# Altium project Power_Board_2.PrjPcb (part 3 of 4)

## Sheet Power_Internal.SchDoc
size A4; SheetNumber: 6
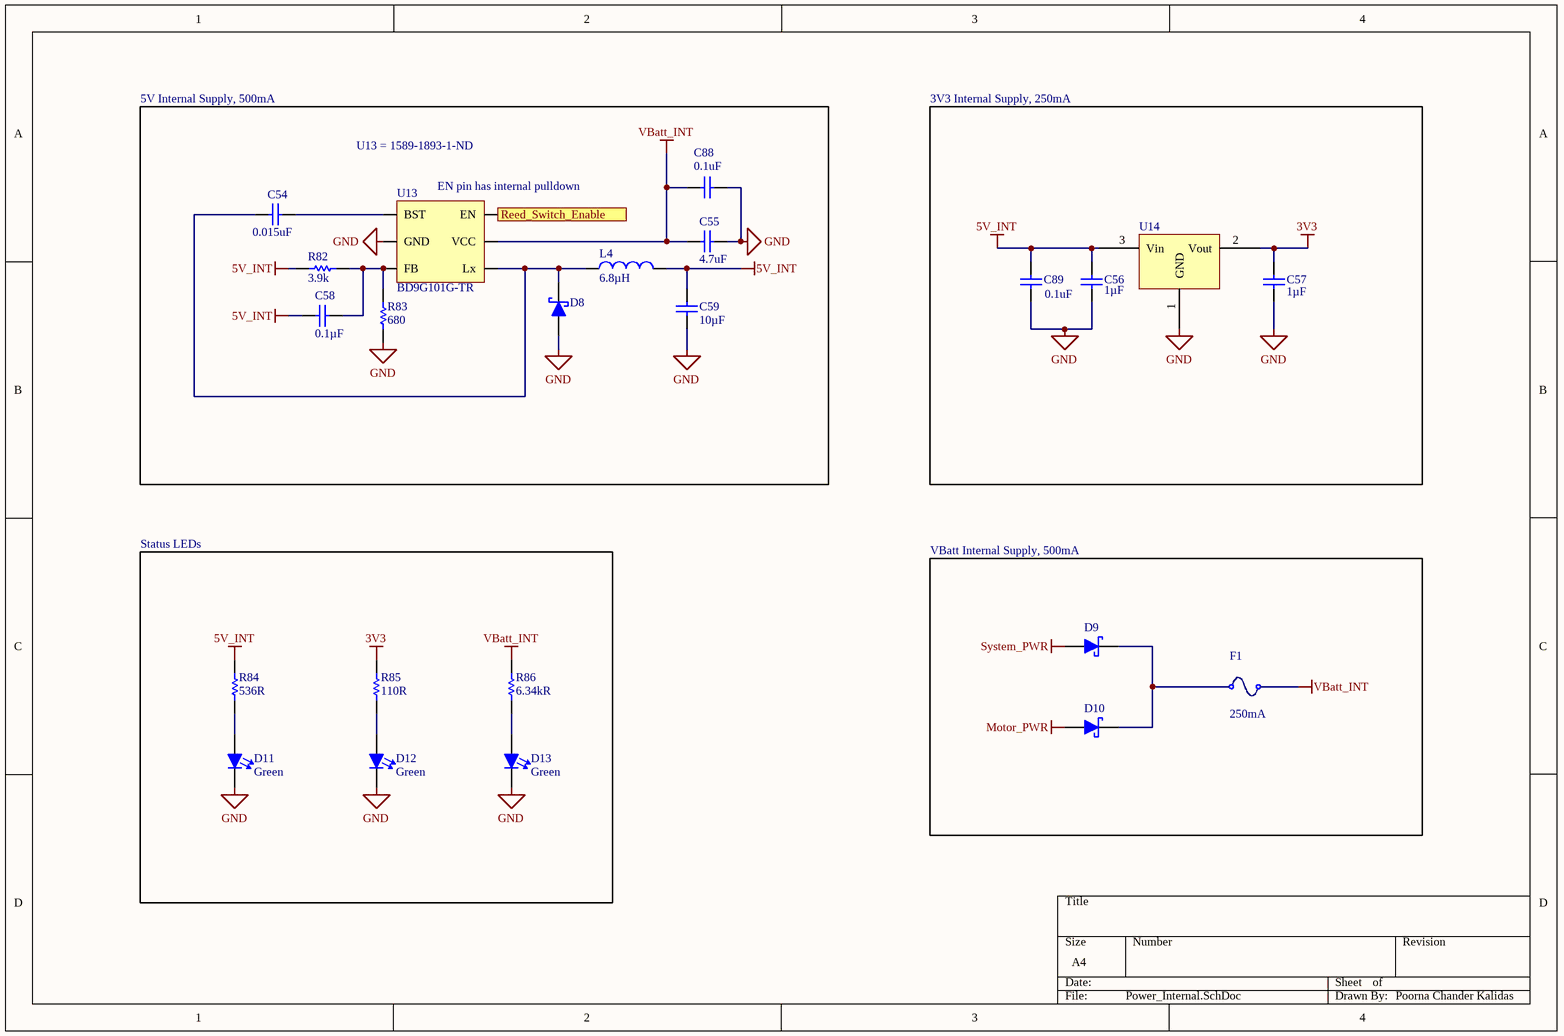
[diagram p4: Power_Internal.SchDoc]

### Parts
C54  value 0.015uF  [CAPC1608N(0603")]  (hidden comment: 0.015uF 50V 0603 SMD, Ceramic)
C55  value 4.7uF  [CAPC3216N(1206")]  (hidden comment: 4.7uF 50V 1206 SMD, Ceramic)
C56  value 1µF  [CAPC1608N(0603")]  (hidden comment: 1uF 25V 0603 SMD, Ceramic)
C57  value 1µF  [CAPC1608N(0603")]  (hidden comment: 1uF 25V 0603 SMD, Ceramic)
C58  Capacitance: 0.1µF  [CAPC1608N(0603")]  (hidden comment: 0.1uF, 50V, 10%, X7R, 1608)
C59  value 10µF  [CAPC2012N(0805")]  (hidden comment: 10uF 10V 0805 SMD, Ceramic)
C88  Capacitance: 0.1uF  [FP-CL10-0_1-IPC_A]  (hidden comment: CL10B104JB8NNNC)
C89  Capacitance: 0.1uF  [FP-CL10-0_1-IPC_A]  (hidden comment: CL10B104JB8NNNC)
D8  RB060M-60TR  [SOD-123]  (value not drawn)
D9  DSS14UTR  [SOD-123F]  (value not drawn)
D10  DSS14UTR  [SOD-123F]  (value not drawn)
D11  Color: Green  [FP-LB_Q39E-MFG]  (hidden comment: LT Q39G-Q1OO-25-1)
D12  Color: Green  [FP-LB_Q39E-MFG]  (hidden comment: LT Q39G-Q1OO-25-1)
D13  Color: Green  [FP-LB_Q39E-MFG]  (hidden comment: LT Q39G-Q1OO-25-1)
F1  Current: 250mA  [1206 SMD]  (hidden comment: SMD Fuse, 250mA, 63V, 1206)
L4  value 6.8µH  [NR4018T6R8M Inductor]  (hidden comment: NR4018T6R8M)
R82  value 3.9k  [RESC2012N(0805")]  (hidden comment: 3.9k, 5%, 1/8W, 0805 SMD)
R83  value 680  [RESC2012N(0805")]  (hidden comment: 680, 5%, 1/8W, 0805 SMD)
R84  Resistance: 536R  [RESC1608X55X30ML15T15]  (hidden comment: ERJ-3EKF5360V)
R85  Resistance: 110R  [RESC1608X55X25ML10T15]  (hidden comment: RC0603FR-07110RL)
R86  Resistance: 6.34kR  [RESC1609X50X30ML10T20]  (hidden comment: CRCW06036K34FKEA)
U13  BD9G101G-TR  [SOT23-6_N]
U14  3.3V 250mA Linear Reg LDO  [SOT95P245X110-3N]  (value not drawn)

### Blocks framed on the sheet
3V3 Internal Supply, 250mA: C56 C57 C89 U14
Status LEDs: D11-D13 R84-R86
VBatt Internal Supply, 500mA: D9 D10 F1

### Ports
Reed_Switch_Enable (in)

### Nets
3V3: C57.2(Cathode) R85.2 U14.2(Vout)
5V_INT: C56.2(Cathode) C58.1(Anode) C59.2(Cathode) C89.1 L4.2 R82.1 R84.1 U14.3(Vin)
GND: C55.1 C56.1(Anode) C57.1(Anode) C59.1(Anode) C88.2 C89.2 D8.A(Anode) D11.1(Cathode) D12.1(Cathode) D13.1(Cathode) R83.1 U13.2(GND) U14.1(GND)
Motor_PWR: D10.A(Anode)
System_PWR: D9.A(Anode)
VBatt_INT: C55.2 C88.1 F1.1 R86.2 U13.5(VCC)
NetC54_1: C54.1 D8.K(Cathode) L4.1 U13.6(Lx)
NetC54_2: C54.2 U13.1(BST)
NetC58_2: C58.2(Cathode) R82.2 R83.2 U13.3(FB)
NetD9_K: D9.K(Cathode) D10.K(Cathode) F1.2
NetD11_2: D11.2(Anode) R84.2
NetD12_2: D12.2(Anode) R85.1
NetD13_2: D13.2(Anode) R86.1
NetQ10_3: U13.4(EN) ; port Reed_Switch_Enable

### Notes on the sheet
- 5V Internal Supply, 500mA
- U13 = 1589-1893-1-ND
- (near U13) EN pin has internal pulldown
- Poorna Chander Kalidas

### Library data of the parts
C54 = CMP-006-0000-3: Capacitor, Ceramic, 50V, +/-10%, 0603 SMD, X7R; Created By: Lyden Smith; Created On: 2017-06-04; Design Item ID: 0.015uF 50V 0603 SMD, Ceramic; Component Type: Standard; Source: AUVic_Schematic_Library_Capacitors.SchLib; Pin Count: 2
C55 = CMP-006-0045-3: Capacitor, Ceramic, 50V, +/- 10%, 1206 SMD, X7R; Created By: Lyden Smith; Created On: 2017-06-04; Component Type: Standard; Pin Count: 2; Design Item ID: 4.7uF 50V 1206 SMD, Ceramic; Source: AUVic_Schematic_Library_Capacitors.SchLib
C56 C57 = CMP-006-0027-1: Capacitor, Ceramic, 25V, +/- 10%, 0603 SMD, X5R; MFG: Murata-Electronics-North-America; MFG#: GRM188R61E105KA12D; Created By: Andy Bates; Publisher: AUVic; Source: AUVic_Schematic_Library_Capacitors.SchLib; Component Type: Standard; Pin Count: 2; PackageDescription: Chip Capacitor; Design Item ID: 1uF 25V 0603 SMD, Ceramic; Published: 16-06-27
C58 = CMP-006-0008-1: CAP CER 0.1UF 50V 10% X7R 1608 (0603); Manufacturer: Samsung Electro-Mechanics America, Inc; Manufacturer Part Number: CL10B104KB8SFNC; RoHS: RoHS Compliant; Category: Capacitors; Stock 1: 743572; Pricing 1: 1=0.12, 10=0.033, 25=0.0232, 100=0.0152, 500=0.01064, 1000=0.00829 (CAD); Packaging: Cut Tape (CT); Tolerance: ±10%; Voltage - Rated: 50V; Temperature Coefficient: X7R; Mounting Type: Surface Mount, MLCC; Operating Temperature: -55°C ~ 125°C; Applications: Boardflex Sensitive; Ratings: -; Package / Case: 0603 (1608 Metric); Size / Dimension: 0.063" L x 0.031" W (1.60mm x 0.80mm); Height - Seated (Max): -; Thickness (Max): 0.035" (0.90mm); Lead Spacing: -; Features: Soft Termination; Lead Style: -; ComponentLink1URL: http://www.samsungsem.com/servlet/FileDownload?type=spec&file=CL10B104KB8SFNC.pdf; ComponentLink1Description: http://www.samsungsem.com/servlet/FileDownload?type=spec&file=CL10B104KB8SFNC.pdf; Design Item ID: 0.1uF, 50V, 10%, X7R, 1608; Component Type: Standard; Source: AUVic_Schematic_Library_Capacitors.SchLib; Pin Count: 2
C59 = CMP-006-0017-1: Capacitor, Ceramic, 10V, +/- 10%, 0805 SMD, X5R; Made By: Andy Bates; Published: 14-06-23; Publisher: AUVic; PackageDescription: Chip Capacitor; Source: AUVic_Schematic_Library_Capacitors.SchLib; Pin Count: 2; Design Item ID: 10uF 10V 0805 SMD, Ceramic; Component Type: Standard
C88 C89 = CMP-00000-4: CAP CER 0.1UF 50V X7R 0603; Material: Ceramic; Tolerance: 5%; Dielectric: X7R; Width: 0.031inch; Min Operating Temperature: -55°C; Contact Plating: Tin; Length: 1.6mm; Case/Package: 0603; Package Quantity: 1; Voltage Rating: 50V; Voltage: 50V; Radiation Hardening: No; Packaging: Tape and Reel; Max Operating Temperature: 125°C; Case Code (Imperial): 0603; Thickness: 0.035inch; Case Code (Metric): 1608; Height: 0.8mm; Mount: Surface Mount; Depth: 0.8mm
D8 = CMP-057-0013-1: Diode, Schottky, 60V, 2A; Created By: Lyden Smith; Date Created: 2017-06-02; Component Type: Standard; Design Item ID: RB060M-60TR; Pin Count: 2; Source: AUVic_Schematic_Library_Diodes.SchLib
D9 D10 = CMP-057-0003-1: Diode, Schottky, 40V, 1A; Source: AUVic_Schematic_Library_Diodes.SchLib; Date Created: 2018-07-11; Component Type: Standard; Design Item ID: DSS14UTR; ComponentLink1Description: Digikey; Pin Count: 2; Created By: Robert Keen; ComponentLink1URL: https://www.digikey.ca/product-detail/en/smc-diode-solutions/DSS14UTR/1655-1927-1-ND/8341869; Publisher: AUVic
D11-D13 = CMP-00064-3: as D1 on sheet Battery_Management; Radiation Hardening: No; Packaging: Tape and Reel; Mount: Surface Mount; Max Operating Temperature: 85°C; Number of Elements: 1; Number of Pins: 2; Min Operating Temperature: -40°C; Depth: 0.9mm; Case/Package: SMD/SMT; Length: 1.7mm
F1 = CMP-027-0003-1: Source: AUVic_Integrated_Library_Fuses.SchLib; Type: SMD; Date Created: 2018-02-05; Component Type: Standard; Created By: Lyden Smith; Design Item ID: SMD Fuse, 250mA, 63V, 1206; Pin Count: 2
L4 = CMP-029-0008-1: 6.8uH 1.06A; Created By: Lyden Smith; Created On: 2017-06-02; Pin Count: 2; Design Item ID: NR4018T6R8M; Component Type: Standard; Source: AUVic_Integrated_Library_Inductors.SchLib
R82 = CMP-047-0041-1: Created By: Lyden Smith; Created On: 2017-06-04; Pin Count: 2; Design Item ID: 3.9k, 5%, 1/8W, 0805 SMD; Component Type: Standard; Source: AUVic_Schematic_Library_Resistors.SchLib
R83 = CMP-047-0063-1: Created By: Lyden Smith; Created On: 2017-06-04; Pin Count: 2; Source: AUVic_Schematic_Library_Resistors.SchLib; Component Type: Standard; Design Item ID: 680, 5%, 1/8W, 0805 SMD
R84 = CMP-00071-2: SMD Chip Resistor, 0603 [1608 Metric], 536 ohm, ERJ3EK Series, 75 V, Thick Film, 100 mW; Tolerance: 1%; Voltage Rating (DC): 50V; Voltage Rating: 75V; Power Rating: 100mW; Temperature Coefficient: 100ppm/°C; Max Operating Temperature: 155°C; Package Quantity: 1; REACH SVHC: No SVHC; Depth: 0.8mm; Composition: Thick Film; Height: 0.022inch; Packaging: Tape and Reel; Contact Plating: Tin; Lead Free: Lead Free; Length: 1.6mm; Case/Package: 0603; Military Standard: Not; Features: Automotive AEC-Q200; Termination: SMD/SMT; Max Power Dissipation: 100mW; Width: 0.8mm; Mount: Surface Mount; Case Code (Metric): 1608; Case Code (Imperial): 0603; Number of Terminations: 2; Min Operating Temperature: -55°C
R85 = CMP-00069-2: RES SMD 110 OHM 1% 1/10W 0603; Max Power Dissipation: 100mW; Voltage Rating (DC): 50V; Temperature Coefficient: 100ppm/°C; Working Voltage: 75V; Military Standard: Not; Termination: SMD/SMT; Number of Terminations: 2; Features: Moisture Resistant; Min Operating Temperature: -55°C; Power Rating: 100mW; Height: 0.022inch; Package Quantity: 1; Lead Free: Lead Free; Tolerance: 1%; Voltage Rating: 50V; Composition: Thick Film; Case Code (Imperial): 0603; Length: 1.6mm; Packaging: Tape and Reel; Case Code (Metric): 1608; Max Operating Temperature: 155°C; Depth: 0.8mm; Case/Package: 0603; Width: 0.031inch
R86 = CMP-00072-2: as R2 on sheet Battery_Management; Depth: 0.85mm; Military Standard: Not; Composition: Thick Film; Case Code (Metric): 1608; Case/Package: 0603; Packaging: Tape and Reel; Max Operating Temperature: 155°C; Tolerance: 1%; Height: 0.45mm; Package Quantity: 10; Case Code (Imperial): 0603; Width: 0.033inch; Length: 1.55mm; REACH SVHC: Unknown; Termination: SMD/SMT; Radiation Hardening: No; Contact Plating: Tin; Weight: 7.1E-05oz; Number of Pins: 2; Min Operating Temperature: -55°C; Features: Automotive AEC-Q200; Number of Terminations: 2; Max Power Dissipation: 100mW
U13 = CMP-045-0010-1: DC-DC Regulator, 6V-42V in, 1V-29.4V out, 500mA; Created on: 2017-06-02; Component Type: Standard; Pin Count: 6; Source: AUVic_Schematic_Library_Regulators.SchLib; Created by: Lyden Smith; Design Item ID: BD9G101G-TR
U14 = CMP-00003-1: IC REG LINEAR 3.3V 250MA SOT23-3; Max Input Voltage: 6.6V; Accuracy: 2%; Polarity: Positive; Number of Outputs: 1; Output Type: Fixed; Dropout Voltage: 400mV; Quiescent Current: 1uA; Min Input Voltage: 2.5V; Min Operating Temperature: -40°C; Supplier 1: Digi-Key; Supplier Part Number 1: AP2138N-3.3TRG1; Width: 1.7mm; Length: 3.02mm; Height: 1.3mm; Output Current: 250mA; Created By: Poorna Chander Kalidas; Number of Regulators: 1; Number of Pins: 3; Package Quantity: 3000; Date Created: June 26, 2020; Output Voltage: 3.3V; Max Operating Temperature: 85°C; Max Output Current: 250mA; Weight: 0.000282oz; Packaging: Tape and Reel; Lead Free: Lead Free; Mount: Surface Mount; Case/Package: SOT-23-3

## Sheet Sensors.SchDoc
size A4; SheetNumber: 9
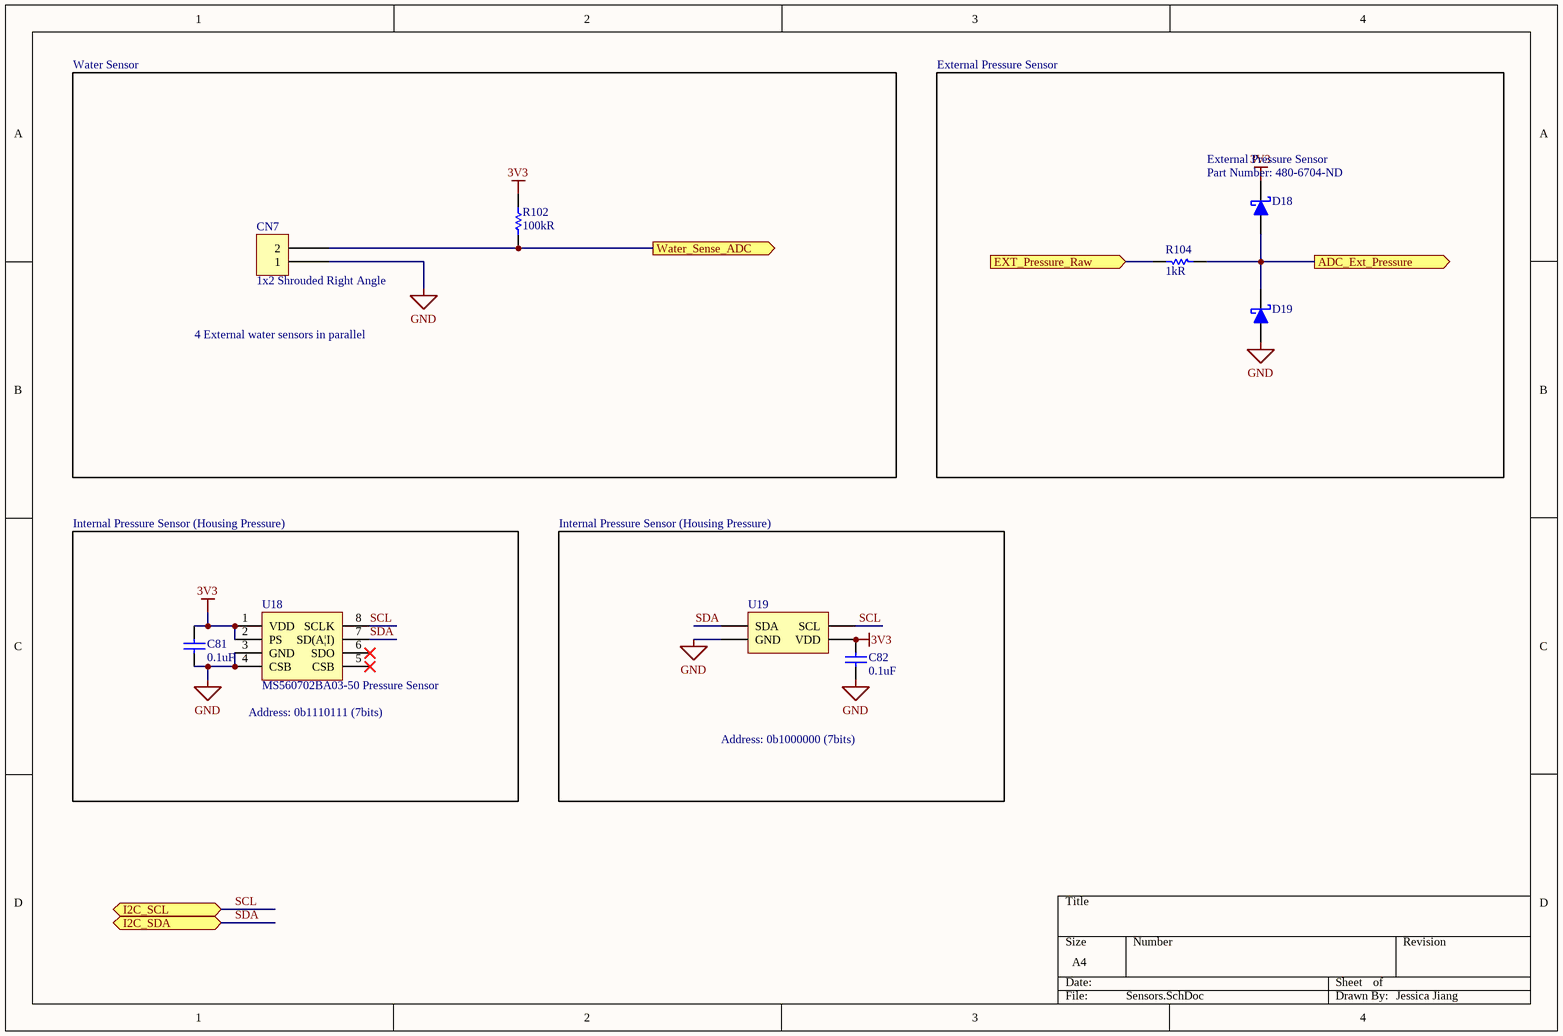
[diagram p5: Sensors.SchDoc]

### Parts
C81  Capacitance: 0.1uF  [FP-CL10-0_1-IPC_A]  (hidden comment: CL10B104JB8NNNC)
C82  Capacitance: 0.1uF  [FP-CL10-0_1-IPC_A]  (hidden comment: CL10B104JB8NNNC)
CN7  1x2 Shrouded Right Angle  [2X1 Female Header]
D18  CUS08F30,H3F  [SC-76]  (value not drawn)
D19  CUS08F30,H3F  [SC-76]  (value not drawn)
R102  Resistance: 100kR  [RESC1609X50X30ML10T20]  (hidden comment: CRCW0603-100KFKEA)
R104  Resistance: 1kR  [RESC1608X55X30ML15T15]  (hidden comment: ERJ3EKF1001V)
U18  MS560702BA03-50 Pressure Sensor  [TE Pressure Sensor (MS560702BA03-50)]
U19  Si700XX  [QFN-6]  (value not drawn)

### Ports
ADC_Ext_Pressure (out), EXT_Pressure_Raw (in), I2C_SCL (bidir), I2C_SDA (bidir), Water_Sense_ADC (out)

### Nets
3V3: C81.1 C82.1 D18.K(Cathode) R102.2 U18.1(VDD) U18.2(PS) U19.5(VDD)
GND: C81.2 C82.2 CN7.1 D19.A(Anode) U18.3(GND) U18.4(CSB) U19.2(GND)
EXT_Pressure_Raw: R104.2 ; port EXT_Pressure_Raw
SCL: U18.8(SCLK) U19.6(SCL) ; port I2C_SCL  [project net I2C_SCL]
SDA: U18.7(SD(A|I)) U19.1(SDA) ; port I2C_SDA  [project net I2C_SDA]
NetCN7_2: CN7.2 R102.1 ; port Water_Sense_ADC
NetD18_A: D18.A(Anode) D19.K(Cathode) R104.1 ; port ADC_Ext_Pressure

Not connected (* = marked no-connect by the designer): U18 5(CSB)* 6(SDO)*

### Notes on the sheet
- Water Sensor
- External Pressure Sensor
- Part Number: 480-6704-ND
- 4 External water sensors in parallel
- Internal Pressure Sensor (Housing Pressure)
- (near U18) Address: 0b1110111 (7bits)
- Address: 0b1000000 (7bits)
- Jessica Jiang

### Library data of the parts
C81 C82 = CMP-00000-4: as C1 on sheet Battery_Management; Case Code (Imperial): 0603; Mount: Surface Mount; Thickness: 0.035inch; Depth: 0.8mm; Packaging: Tape and Reel; Package Quantity: 1; Dielectric: X7R; Height: 0.8mm; Voltage: 50V; Radiation Hardening: No; Max Operating Temperature: 125°C; Voltage Rating: 50V; Case/Package: 0603; Min Operating Temperature: -55°C; Case Code (Metric): 1608; Length: 1.6mm; Contact Plating: Tin; Width: 0.031inch
CN7 = CMP-00010-3: 02 MTE HDR SRRA LATCH; PCB Mount Retention: Without; Number of Positions: 2; Row Spacing: 0.1inch; Contact Retention: Yes (With); PCB Mount Alignment: No (Without); Current Rating: 3A; PCB Thickness: 0.062inch; Insulation Resistance: 5GR; Gender: Male; Connector Type: Plug,Header,Pin; Tail Length: 3.3mm; Approvals: CSA; Pitch: 2.54mm; Contact Resistance: 15mR; Color: Black; REACH SVHC: Unknown; Contact Shape: Square; Number of Contacts: 2; PCB Mounting Orientation: Right Angle; Housing Material: Thermoplastic; Max Operating Temperature: 105°C; Mount: Through Hole; Package Quantity: 68; Contact Current Rating: 3A; Housing Color: Black; Contact Material: Brass; Min Operating Temperature: -65°C; Packaging: Rail/Tube; Height: 13.59mm; ELV: Compliant; Number of Rows: 1; Orientation: Right Angle; Lead Free: Lead Free; Mating Retention: Yes (With); Strain Relief: No (Without); Length: 7.62mm; Flammability Rating: UL94 V-0; Contact Plating: Gold,Tin,Matte; Contact Mating Length: 0.23inch; Contact Gender: Male; Termination: Crimp; Backwall/Post Interruptions: No (Without); Depth: 13.59mm; Mating Alignment: Yes (With)
D18 D19 = CMP-057-0000-2: Diode Schottky 30V 800mA Surface Mount USC; Peak Non-Repetitive Surge Current: 5A; Element Configuration: Single; Peak Reverse Current: 50uA; Packaging: Tape and Reel; Mount: Surface Mount; Average Rectified Current: 800mA; Case/Package: SOD; Max Reverse Voltage (DC): 30V; Min Operating Temperature: -55°C; Contact Plating: Tin,Silver; Max Repetitive Reverse Voltage (Vrrm): 30V; Number of Pins: 2; Max Operating Temperature: 125°C
R102 = CMP-00036-2: Resistor; Thick Film; 100 Kilohms; 0.1 W; 1%; SMT; 0603; TCR 37 ppm/DegC; Tape and Reel; Voltage Rating: 75V; Temperature Coefficient: 100ppm/°C; Power Rating: 100mW; Number of Terminations: 2; Number of Pins: 2; Contact Plating: Tin,Lead; Lead Free: Lead Free; Voltage Rating (DC): 75V; Package Quantity: 10; REACH SVHC: Unknown; Min Operating Temperature: -55°C; Height: 0.45mm; Composition: Thick Film; Case Code (Metric): 1608; Weight: 7.1E-05oz; Depth: 0.85mm; Features: Automotive AEC-Q200; Military Standard: Not; Tolerance: 1%; Radiation Hardening: No; Max Power Dissipation: 100mW; Case Code (Imperial): 0603; Max Operating Temperature: 155°C; Packaging: Tape and Reel; Width: 0.033inch; Case/Package: 0603; Termination: SMD/SMT; Length: 1.55mm
R104 = CMP-00062-2: Res Thick Film 0603 1K Ohm 1% 1/10W ±100ppm/°C Molded SMD Punched Carrier T/R; Voltage Rating: 75V; Max Power Dissipation: 100mW; Min Operating Temperature: -55°C; Radiation Hardening: No; Features: Automotive AEC-Q200; Length: 1.6mm; Mount: Surface Mount; Composition: Thick Film; Military Standard: Not; Tolerance: 1%; Height: 0.45mm; Depth: 0.8mm; Case Code (Imperial): 0603; Package Quantity: 5000; REACH SVHC: No SVHC; Termination: SMD/SMT; Temperature Coefficient: 100ppm/°C; Width: 0.8mm; Max Operating Temperature: 155°C; Lead Free: Lead Free; Voltage Rating (DC): 75V; Number of Pins: 2; Number of Terminations: 2; Contact Plating: Tin; Packaging: Tape and Reel; Case Code (Metric): 1608; Case/Package: 0603; Power Rating: 100mW
U18 = CMP-048-0005-2: 1kPa to 120 kPa; Made by: Andy Bates; Created on: 2017-09-11; Component Type: Standard; Source: AUVic_Schematic_Library_Sensors.SchLib; Design Item ID: MS560702BA03-50 Pressure Sensor; Pin Count: 8
U19 = CMP-048-0009-1: I2C Humidity and Temperature Sensor; Made by: Andy Bates; Design Item ID: Si700XX; Component Type: Standard; Pin Count: 4; Source: AUVic_Schematic_Library_Sensors.SchLib; Created on: 2019/09/08

## Sheet Reed_Switch.SchDoc
size A4; SheetNumber: 5
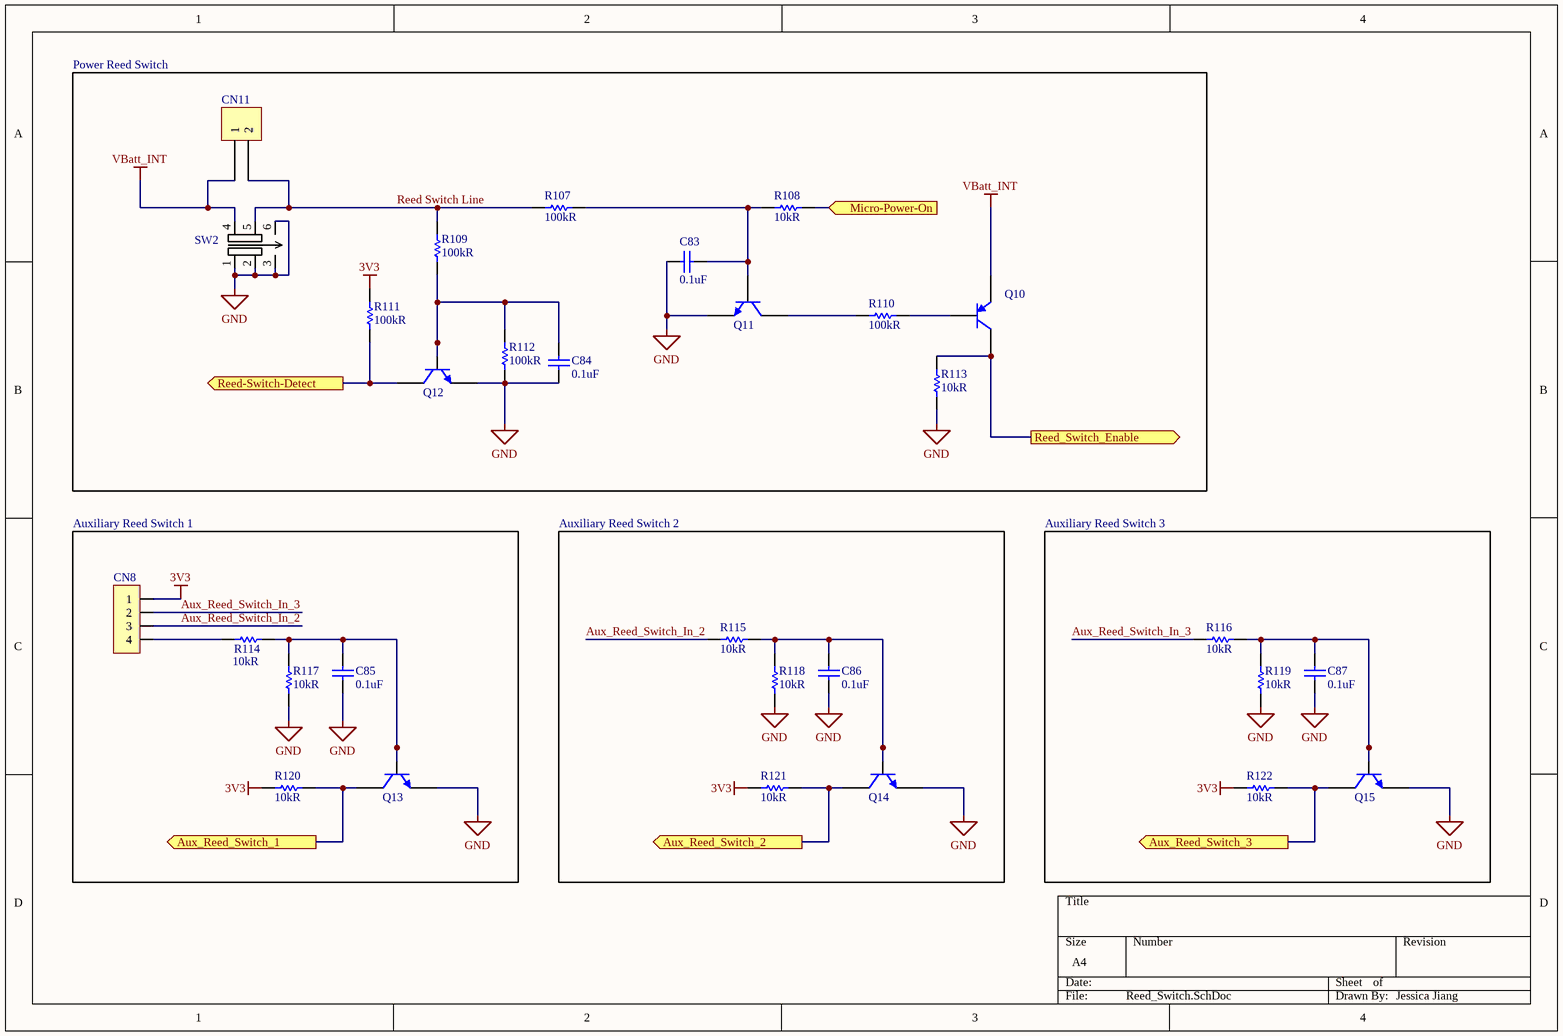
[diagram p6: Reed_Switch.SchDoc]

### Parts
C83  Capacitance: 0.1uF  [FP-CL10-0_1-IPC_A]  (hidden comment: CL10B104JB8NNNC)
C84  Capacitance: 0.1uF  [FP-CL10-0_1-IPC_A]  (hidden comment: CL10B104JB8NNNC)
C85  Capacitance: 0.1uF  [FP-CL10-0_1-IPC_A]  (hidden comment: CL10B104JB8NNNC)
C86  Capacitance: 0.1uF  [FP-CL10-0_1-IPC_A]  (hidden comment: CL10B104JB8NNNC)
C87  Capacitance: 0.1uF  [FP-CL10-0_1-IPC_A]  (hidden comment: CL10B104JB8NNNC)
CN8  Header, Male, 1x4, RA, Pitch 0.1" (2.54mm)  [HEADER, MALE, SHROUDED, 4x1, PITCH 0.1" (2.54mm), RA]  (value not drawn)
CN11  1x2 Shrouded Right Angle  [2X1 Female Header]  (value not drawn)
Q10  BC856A,215  [SOT-23]  (value not drawn)
Q11  BC846B,215  [SOT-23]  (value not drawn)
Q12  BC846B,215  [SOT-23]  (value not drawn)
Q13  BC846B,215  [SOT-23]  (value not drawn)
Q14  BC846B,215  [SOT-23]  (value not drawn)
Q15  BC846B,215  [SOT-23]  (value not drawn)
R107  Resistance: 100kR  [RESC1609X50X30ML10T20]  (hidden comment: CRCW0603-100KFKEA)
R108  Resistance: 10kR  [RESC1608X55X25ML10T15]  (hidden comment: RC0603FR-0710KL)
R109  Resistance: 100kR  [RESC1609X50X30ML10T20]  (hidden comment: CRCW0603-100KFKEA)
R110  Resistance: 100kR  [RESC1609X50X30ML10T20]  (hidden comment: CRCW0603-100KFKEA)
R111  Resistance: 100kR  [RESC1609X50X30ML10T20]  (hidden comment: CRCW0603-100KFKEA)
R112  Resistance: 100kR  [RESC1609X50X30ML10T20]  (hidden comment: CRCW0603-100KFKEA)
R113  Resistance: 10kR  [RESC1608X55X25ML10T15]  (hidden comment: RC0603FR-0710KL)
R114  Resistance: 10kR  [RESC1608X55X25ML10T15]  (hidden comment: RC0603FR-0710KL)
R115  Resistance: 10kR  [RESC1608X55X25ML10T15]  (hidden comment: RC0603FR-0710KL)
R116  Resistance: 10kR  [RESC1608X55X25ML10T15]  (hidden comment: RC0603FR-0710KL)
R117  Resistance: 10kR  [RESC1608X55X25ML10T15]  (hidden comment: RC0603FR-0710KL)
R118  Resistance: 10kR  [RESC1608X55X25ML10T15]  (hidden comment: RC0603FR-0710KL)
R119  Resistance: 10kR  [RESC1608X55X25ML10T15]  (hidden comment: RC0603FR-0710KL)
R120  Resistance: 10kR  [RESC1608X55X25ML10T15]  (hidden comment: RC0603FR-0710KL)
R121  Resistance: 10kR  [RESC1608X55X25ML10T15]  (hidden comment: RC0603FR-0710KL)
R122  Resistance: 10kR  [RESC1608X55X25ML10T15]  (hidden comment: RC0603FR-0710KL)
SW2  DPDT, 12V, 200mA, SMT  [CL-2B-22A]  (value not drawn)

### Blocks framed on the sheet
Power Reed Switch: C83 C84 CN11 Q10-Q12 R107-R113 SW2
Auxiliary Reed Switch 1: C85 CN8 Q13 R114 R117 R120
Auxiliary Reed Switch 2: C86 Q14 R115 R118 R121
Auxiliary Reed Switch 3: C87 Q15 R116 R119 R122

### Ports
Aux_Reed_Switch_1 (out), Aux_Reed_Switch_2 (out), Aux_Reed_Switch_3 (out), Micro-Power-On (in), Reed-Switch-Detect (out), Reed_Switch_Enable (out)

### Nets
3V3: CN8.1 R111.2 R120.2 R121.2 R122.1
GND: C83.2 C84.2 C85.2 C86.2 C87.2 Q11.2(E) Q12.2(E) Q13.2(E) Q14.2(E) Q15.2(E) R112.1 R113.2 R117.1 R118.1 R119.2 SW2.1 SW2.2 SW2.3 SW2.6
VBatt_INT: CN11.1 Q10.2(E) SW2.4
Aux_Reed_Switch_In_2: CN8.3 R115.2
Aux_Reed_Switch_In_3: CN8.2 R116.2
Reed Switch Line: CN11.2 R107.2 R109.2 SW2.5
NetC83_1: C83.1 Q11.1(B) R107.1 R108.1
NetC84_1: C84.1 Q12.1(B) R109.1 R112.2
NetC85_1: C85.1 Q13.1(B) R114.1 R117.2
NetC86_1: C86.1 Q14.1(B) R115.1 R118.2
NetC87_1: C87.1 Q15.1(B) R116.1 R119.1
NetCN8_4: CN8.4 R114.2
NetQ10_1: Q10.1(B) R110.2
NetQ10_3: Q10.3(C) R113.1 ; port Reed_Switch_Enable
NetQ11_3: Q11.3(C) R110.1
NetQ12_3: Q12.3(C) R111.1 ; port Reed-Switch-Detect
NetQ13_3: Q13.3(C) R120.1 ; port Aux_Reed_Switch_1
NetQ14_3: Q14.3(C) R121.1 ; port Aux_Reed_Switch_2
NetQ15_3: Q15.3(C) R122.2 ; port Aux_Reed_Switch_3
NetR108_2: R108.2 ; port Micro-Power-On

### Notes on the sheet
- Jessica Jiang

### Library data of the parts
C83-C87 = CMP-00000-4: CAP CER 0.1UF 50V X7R 0603; Tolerance: 5%; Material: Ceramic; Case Code (Imperial): 0603; Mount: Surface Mount; Thickness: 0.035inch; Depth: 0.8mm; Packaging: Tape and Reel; Package Quantity: 1; Dielectric: X7R; Height: 0.8mm; Voltage: 50V; Radiation Hardening: No; Max Operating Temperature: 125°C; Voltage Rating: 50V; Case/Package: 0603; Min Operating Temperature: -55°C; Case Code (Metric): 1608; Length: 1.6mm; Contact Plating: Tin; Width: 0.031inch
CN8 = CMP-005-0029-3: Connector Header Through Hole, Right Angle 4 position 0.100" (2.54mm); Source: AUVic_Schematic_Library_Connectors.SchLib; Created On: 2020-05-20; Pin Count: 4; Component Type: Standard; Design Item ID: Header, Male, 1x4, RA, Pitch 0.1" (2.54mm); Created By: Miguel Manguerra
CN11 = CMP-00010-3: 02 MTE HDR SRRA LATCH; PCB Mount Retention: Without; Number of Positions: 2; Row Spacing: 0.1inch; Contact Retention: Yes (With); PCB Mount Alignment: No (Without); Current Rating: 3A; PCB Thickness: 0.062inch; Insulation Resistance: 5GR; Gender: Male; Connector Type: Plug,Header,Pin; Tail Length: 3.3mm; Approvals: CSA; Pitch: 2.54mm; Contact Resistance: 15mR; Color: Black; REACH SVHC: Unknown; Contact Shape: Square; Number of Contacts: 2; PCB Mounting Orientation: Right Angle; Housing Material: Thermoplastic; Max Operating Temperature: 105°C; Mount: Through Hole; Package Quantity: 68; Contact Current Rating: 3A; Housing Color: Black; Contact Material: Brass; Min Operating Temperature: -65°C; Packaging: Rail/Tube; Height: 13.59mm; ELV: Compliant; Number of Rows: 1; Orientation: Right Angle; Lead Free: Lead Free; Mating Retention: Yes (With); Strain Relief: No (Without); Length: 7.62mm; Flammability Rating: UL94 V-0; Contact Plating: Gold,Tin,Matte; Contact Mating Length: 0.23inch; Contact Gender: Male; Termination: Crimp; Backwall/Post Interruptions: No (Without); Depth: 13.59mm; Mating Alignment: Yes (With)
Q10 = CMP-052-0003-1: PNP 65V 100mA 250mW; Published: 8-Jun-2000; LatestRevisionDate: 15-Jan-2003; Component Type: Standard; Pin Count: 3; Source: AUVic_Schematic_Library_Transistors.SchLib; Design Item ID: BC856A,215
Q11-Q15 = CMP-052-0002-1: NPN 65V 100mA 250mW; Published: 8-Jun-2000; LatestRevisionDate: 09-Sep-2016; DatasheetVersion: 1997; Publisher: Andy Bates; Pin Count: 3; Component Type: Standard; Source: AUVic_Schematic_Library_Transistors.SchLib; Design Item ID: BC846B,215
R107 R109-R112 = CMP-00036-2: Resistor; Thick Film; 100 Kilohms; 0.1 W; 1%; SMT; 0603; TCR 37 ppm/DegC; Tape and Reel; Voltage Rating: 75V; Temperature Coefficient: 100ppm/°C; Power Rating: 100mW; Number of Terminations: 2; Number of Pins: 2; Contact Plating: Tin,Lead; Lead Free: Lead Free; Voltage Rating (DC): 75V; Package Quantity: 10; REACH SVHC: Unknown; Min Operating Temperature: -55°C; Height: 0.45mm; Composition: Thick Film; Case Code (Metric): 1608; Weight: 7.1E-05oz; Depth: 0.85mm; Features: Automotive AEC-Q200; Military Standard: Not; Tolerance: 1%; Radiation Hardening: No; Max Power Dissipation: 100mW; Case Code (Imperial): 0603; Max Operating Temperature: 155°C; Packaging: Tape and Reel; Width: 0.033inch; Case/Package: 0603; Termination: SMD/SMT; Length: 1.55mm
R108 R113-R122 = CMP-00037-2: Res General Purpose Thick Film 0603 10K Ohm 1% 1/10W ±100ppm/°C Molded SMD Paper T/R; Power Rating: 100mW; Voltage Rating (DC): 50V; Voltage Rating: 75V; Case/Package: 0603; Weight: 7.1E-05oz; Case Code (Imperial): 0603; Composition: Thick Film; Depth: 0.8mm; Min Operating Temperature: -55°C; Width: 0.8mm; Height: 0.45mm; Military Standard: Not; Packaging: Tape and Reel; Termination: SMD/SMT; Lead Free: Lead Free; Temperature Coefficient: 100ppm/°C; Number of Pins: 2; Max Operating Temperature: 155°C; Lead Pitch: 0.3mm; REACH SVHC: No SVHC; Case Code (Metric): 1608; Tolerance: 1%; Length: 1.6mm
SW2 = CMP-050-0002-2: Design Item ID: DPDT, 12V, 200mA, SMT; Source: AUVic_Integrated_Library_Switches.SchLib; Date Created: 2017-09-20; Pin Count: 6; Created By: Lyden Smith; Component Type: Standard

## Sheet Communications.SchDoc
size A4; SheetNumber: 8
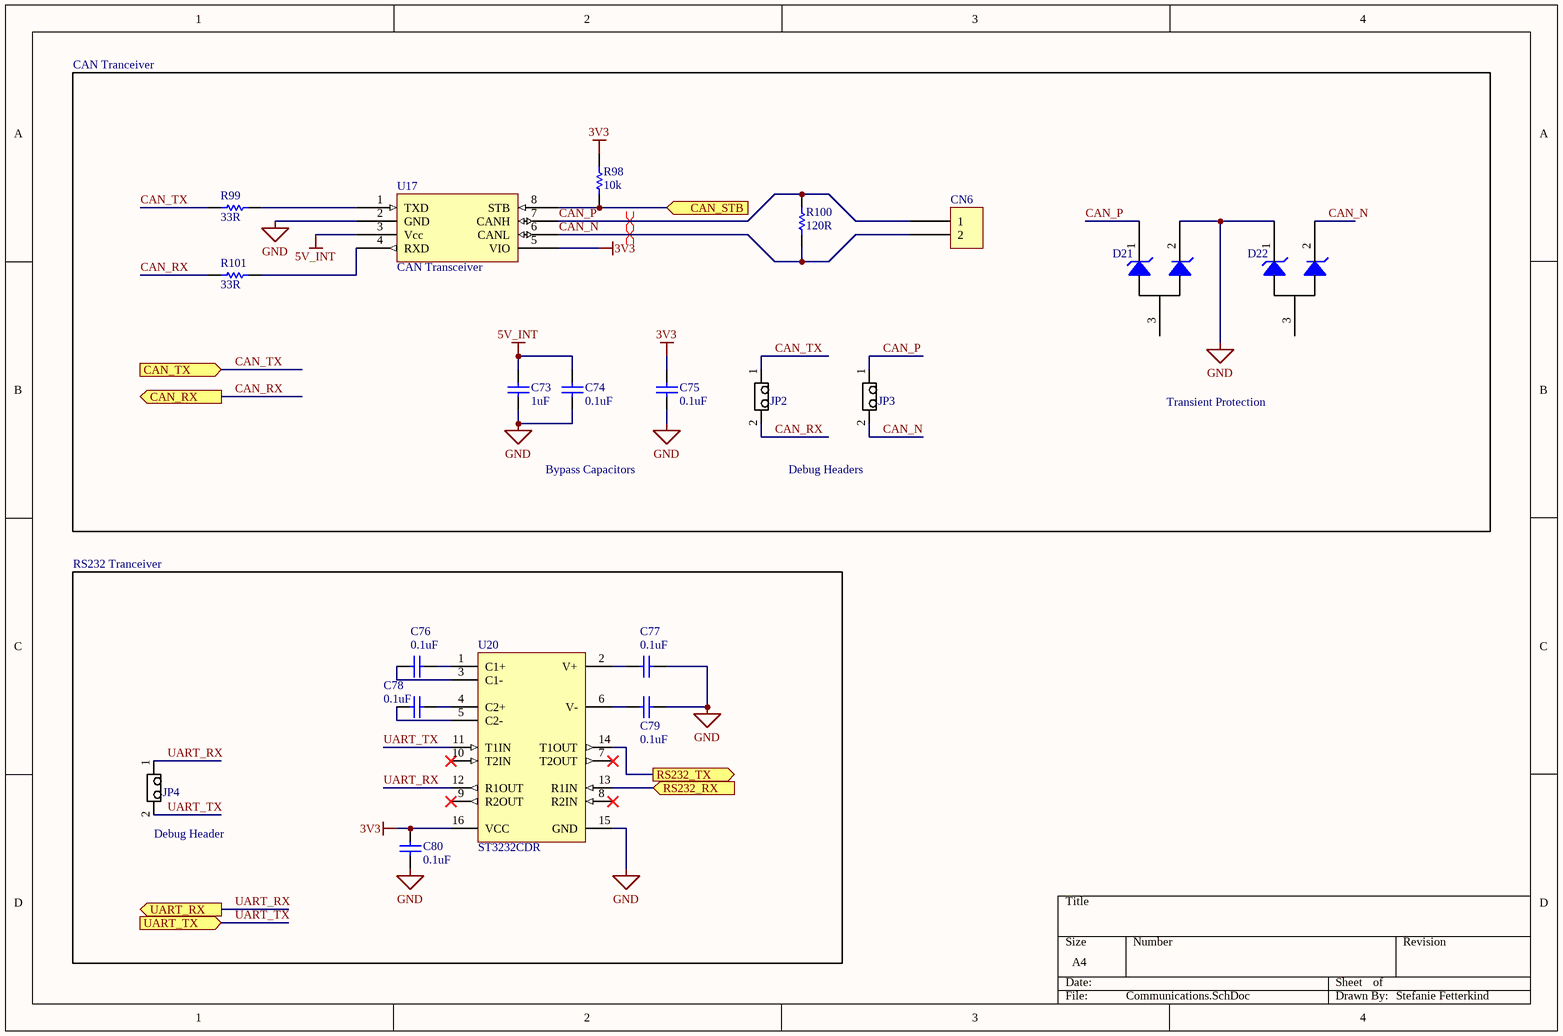
[diagram p7: Communications.SchDoc]

### Parts
C73  Capacitance: 1uF  [0803 CAP]  (hidden comment: CL21B105KBFNNNG)
C74  Capacitance: 0.1uF  [FP-CL10-0_1-IPC_A]  (hidden comment: CL10B104JB8NNNC)
C75  Capacitance: 0.1uF  [FP-CL10-0_1-IPC_A]  (hidden comment: CL10B104JB8NNNC)
C76  Capacitance: 0.1uF  [FP-CL10-0_1-IPC_A]  (hidden comment: CL10B104JB8NNNC)
C77  Capacitance: 0.1uF  [FP-CL10-0_1-IPC_A]  (hidden comment: CL10B104JB8NNNC)
C78  Capacitance: 0.1uF  [FP-CL10-0_1-IPC_A]  (hidden comment: CL10B104JB8NNNC)
C79  Capacitance: 0.1uF  [FP-CL10-0_1-IPC_A]  (hidden comment: CL10B104JB8NNNC)
C80  Capacitance: 0.1uF  [FP-CL10-0_1-IPC_A]  (hidden comment: CL10B104JB8NNNC)
CN6  1x2 Shrouded Right Angle  [2X1 Female Header]  (value not drawn)
D21  PESD36VS2UT,215  [SOT95P245X110-3N]  (value not drawn)
D22  PESD36VS2UT,215  [SOT95P245X110-3N]  (value not drawn)
JP2  1x2 Male Header  [2X1 Males Header]  (value not drawn)
JP3  1x2 Male Header  [2X1 Males Header]  (value not drawn)
JP4  1x2 Male Header  [2X1 Males Header]  (value not drawn)
R98  value 10k  [RESC1608N(0603")]  (hidden comment: 10kR, 1%, 1/10W, 0603 SMD)
R99  Resistance: 33R  [RESC1608X55X25ML10T15]  (hidden comment: RC0603FR-0733RL)
R100  Resistance: 120R  [RESC1608X55X25ML10T15]  (hidden comment: RC0603FR-07120RL)
R101  Resistance: 33R  [RESC1608X55X25ML10T15]  (hidden comment: RC0603FR-0733RL)
U17  CAN Transceiver  [8-SOIC]
U20  ST3232CDR  [STM-SO-16_M]

### Ports
CAN_RX (out), CAN_STB (in), CAN_TX (in), RS232_RX (in), RS232_TX (out), UART_RX (out), UART_TX (in)

### Nets
3V3: C75.1 C80.2 R98.2 U17.5(VIO) U20.16(VCC)
5V_INT: C73.1 C74.1 U17.3(Vcc)
GND: C73.2 C74.2 C75.2 C77.2 C79.2 C80.1 D21.2(Cathode_2) D22.1(Cathode_1) U17.2(GND) U20.15(GND)
CAN_N: CN6.2 D22.2(Cathode_2) JP3.2 R100.1 U17.6(CANL)
CAN_P: CN6.1 D21.1(Cathode_1) JP3.1 R100.2 U17.7(CANH)
CAN_RX: JP2.2 R101.2 ; port CAN_RX
CAN_TX: JP2.1 R99.2 ; port CAN_TX
RS232_RX: U20.13(R1IN) ; port RS232_RX
RS232_TX: U20.14(T1OUT) ; port RS232_TX
UART_RX: JP4.1 U20.12(R1OUT) ; port UART_RX
UART_TX: JP4.2 U20.11(T1IN) ; port UART_TX
NetC76_1: C76.1 U20.3(C1-)
NetC76_2: C76.2 U20.1(C1+)
NetC77_1: C77.1 U20.2(V+)
NetC78_1: C78.1 U20.5(C2-)
NetC78_2: C78.2 U20.4(C2+)
NetC79_1: C79.1 U20.6(V-)
NetR98_1: R98.1 U17.8(STB) ; port CAN_STB
NetR99_1: R99.1 U17.1(TXD)
NetR101_1: R101.1 U17.4(RXD)

Not connected (* = marked no-connect by the designer): D21 3(Common_Anode); D22 3(Common_Anode); U20 7(T2OUT)* 8(R2IN)* 9(R2OUT)* 10(T2IN)*

### Layout directives
differential pair: CAN_N, CAN_P

### Notes on the sheet
- CAN Tranceiver
- Transient Protection
- Bypass Capacitors
- Debug Headers
- RS232 Tranceiver
- (near JP4) Debug Header
- Stefanie Fetterkind

### Library data of the parts
C73 = CMP-00005-3: SAMSUNG ELECTRO-MECHANICS - CL21B105KBFNNNG - MLCC CAPACITORS; Tolerance: 10%; Voltage Rating: 50V; Material: Ceramic; Dielectric: X7R; Case/Package: 0805; Contact Plating: Tin; Max Operating Temperature: 125°C; Termination: Wraparound; Package Quantity: 3000; Depth: 1.25mm; Mount: Surface Mount; Min Operating Temperature: -55°C; Thickness: 0.053inch; Packaging: Tape and Reel; Voltage: 50V; Case Code (Metric): 2012; Length: 2mm; Case Code (Imperial): 0805; Width: 0.049inch
C74-C80 = CMP-00000-4: as C83-C87 on sheet Reed_Switch; Case Code (Imperial): 0603; Mount: Surface Mount; Thickness: 0.035inch; Depth: 0.8mm; Packaging: Tape and Reel; Package Quantity: 1; Dielectric: X7R; Height: 0.8mm; Voltage: 50V; Radiation Hardening: No; Max Operating Temperature: 125°C; Voltage Rating: 50V; Case/Package: 0603; Min Operating Temperature: -55°C; Case Code (Metric): 1608; Length: 1.6mm; Contact Plating: Tin; Width: 0.031inch
CN6 = CMP-00010-3: as CN11 on sheet Reed_Switch; Color: Black; REACH SVHC: Unknown; Contact Shape: Square; Number of Contacts: 2; PCB Mounting Orientation: Right Angle; Housing Material: Thermoplastic; Max Operating Temperature: 105°C; Mount: Through Hole; Package Quantity: 68; Contact Current Rating: 3A; Housing Color: Black; Contact Material: Brass; Min Operating Temperature: -65°C; Packaging: Rail/Tube; Height: 13.59mm; ELV: Compliant; Number of Rows: 1; Orientation: Right Angle; Lead Free: Lead Free; Mating Retention: Yes (With); Strain Relief: No (Without); Length: 7.62mm; Flammability Rating: UL94 V-0; Contact Plating: Gold,Tin,Matte; Contact Mating Length: 0.23inch; Contact Gender: Male; Termination: Crimp; Backwall/Post Interruptions: No (Without); Depth: 13.59mm; Mating Alignment: Yes (With)
D21 D22 = CMP-058-0000-2: TVS DIODE 36V 60V SOT23; Date Created: 2020-05-18; Created By: Miguel Manguerra; Design Item ID: PESD36VS2UT,215; Component Type: Standard; Pin Count: 3; Source: AUVic_Schematic_Library_Diodes.SchLib
JP2-JP4 = CMP-004-0001-1: Made By: Andy Bates; Source: AUVic_Schematic_Library_Connectors.SchLib; Pin Count: 2; Design Item ID: 1x2 Male Header; Component Type: Standard
R98 = CMP-047-0013-1: Owned By: AUVic; Made By: Ashwin Sira; Design Item ID: 10kR, 1%, 1/10W, 0603 SMD; Pin Count: 2; Component Type: Standard; Created On: 14-05-31; Last Edited: 14-05-31; Source: AUVic_Schematic_Library_Resistors.SchLib
R99 R101 = CMP-00060-2: Res Thick Film 0603 33 Ohm 1% 1/10W +/-100ppm/ßC Molded SMD Paper T/R; Max Power Dissipation: 100mW; Voltage Rating: 75V; Voltage Rating (DC): 50V; Temperature Coefficient: 100ppm/°C; Depth: 0.8mm; Military Standard: Not; Min Operating Temperature: -55°C; Termination: SMD/SMT; Weight: 7.1E-05oz; Number of Terminations: 2; Height: 0.45mm; Power Rating: 100mW; Composition: Thick Film; Length: 1.6mm; Packaging: Tape and Reel; Lead Pitch: 0.3mm; Lead Free: Lead Free; Max Operating Temperature: 155°C; REACH SVHC: No SVHC; Features: Moisture Resistant; Tolerance: 1%; Case/Package: 0603; Package Quantity: 1; Width: 0.8mm; Case Code (Metric): 1608; Number of Pins: 2; Case Code (Imperial): 0603
R100 = CMP-00061-2: Res Thick Film 0603 120 Ohm 1% 0.1W(1/10W) ±100ppm/C Epoxy SMD T/R; Power Rating: 100mW; Voltage Rating (DC): 50V; Temperature Coefficient: 100ppm/°C; Depth: 0.8mm; Max Operating Temperature: 155°C; Case/Package: 0603; Lead Free: Lead Free; Height: 0.022inch; Length: 1.6mm; Case Code (Metric): 1608; Package Quantity: 1; Features: Moisture Resistant; Termination: SMD/SMT; Military Standard: Not; Number of Pins: 2; Width: 0.031inch; REACH SVHC: No SVHC; Max Power Dissipation: 100mW; Min Operating Temperature: -55°C; Packaging: Tape and Reel; Composition: Thick Film; Tolerance: 1%; Voltage Rating: 50V; Number of Terminations: 2; Case Code (Imperial): 0603
U17 = CMP-032-0000-2: 1/1 Transceiver Half CANbus 8-SO; Data Rate: 1Mbps; Max Supply Voltage: 5.5V; Propagation Delay: 250ns; Number of Transceivers: 1; Nominal Supply Current: 70mA; Min Supply Voltage: 4.5V; Min Operating Temperature: -40°C; Radiation Hardening: No; Packaging: Tape and Reel; Turn-On Delay Time: 250ns; Case/Package: SO; Contact Plating: Gold; Package Quantity: 2500; Number of Pins: 8; Max Supply Current: 70mA; Max Operating Temperature: 150°C; Interface: CAN; Mount: Surface Mount; Lead Free: Lead Free
U20 = CMP-00015-1: Dual Transmitter/Receiver RS-232 16-Pin SO T/R; Data Rate: 400Kbps; Max Supply Current: 2mA; Number of Drivers: 2; Nominal Supply Current: 300uA; ESD Protection: No; Max Supply Voltage: 5.5V; Output Voltage: 5.4V; Number of Transceivers: 1; Min Supply Voltage: 3V; Logic Function: Receiver; Contact Plating: Tin,Matte; REACH SVHC: No SVHC; Min Operating Temperature: 0°C; Height: 1.65mm; Packaging: Tape and Reel; Lead Free: Lead Free; Number of Receivers: 2; Number of Pins: 16; Length: 10mm; Number of Transmitters: 2; Case/Package: SOIC; Width: 4mm; Package Quantity: 1; Interface: RS-232; Mount: Surface Mount; Radiation Hardening: No; Max Operating Temperature: 70°C

## Sheet 16V_VBatt_External.SchDoc
size A4; SheetNumber: 4
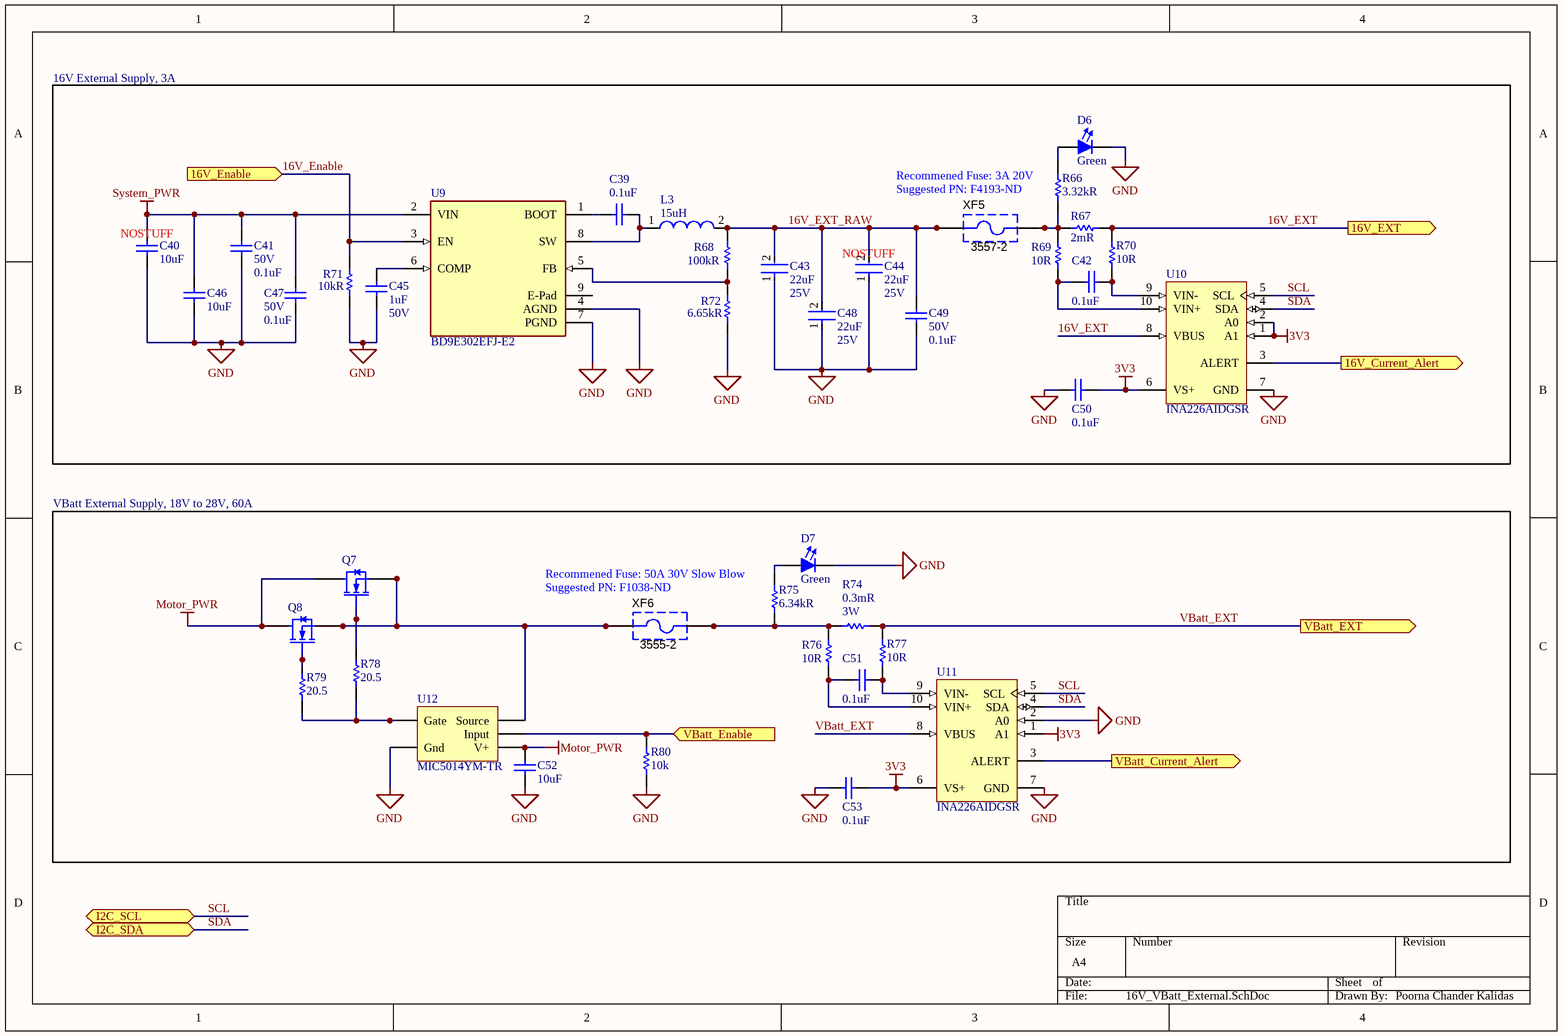
[diagram p8: 16V_VBatt_External.SchDoc]

### Parts
C39  Capacitance: 0.1uF  [FP-CL10-0_1-IPC_A]  (hidden comment: CL10B104JB8NNNC)
C40  Capacitance: 10uF  [CAPC3216X180X50ML20T30]  (hidden comment: CL31B106KBHNNNE)
C41  Voltage: 50V  Capacitance: 0.1uF  [FP-CL10-0_1-IPC_A]  (hidden comment: CL10B104JB8NNNC)
C42  Capacitance: 0.1uF  [FP-CL10-0_1-IPC_A]  (hidden comment: CL10B104JB8NNNC)
C43  Capacitance: 22uF  Voltage: 25V  [FP-GRM32-IPC_A]  (hidden comment: GRM32ER71E226ME15K)
C44  Capacitance: 22uF  Voltage: 25V  [FP-GRM32-IPC_A]  (hidden comment: GRM32ER71E226ME15K)
C45  Capacitance: 1uF  Voltage: 50V  [0803 CAP]  (hidden comment: CL21B105KBFNNNG)
C46  Capacitance: 10uF  [CAPC3216X180X50ML20T30]  (hidden comment: CL31B106KBHNNNE)
C47  Voltage: 50V  Capacitance: 0.1uF  [FP-CL10-0_1-IPC_A]  (hidden comment: CL10B104JB8NNNC)
C48  Capacitance: 22uF  Voltage: 25V  [FP-GRM32-IPC_A]  (hidden comment: GRM32ER71E226ME15K)
C49  Voltage: 50V  Capacitance: 0.1uF  [FP-CL10-0_1-IPC_A]  (hidden comment: CL10B104JB8NNNC)
C50  Capacitance: 0.1uF  [FP-CL10-0_1-IPC_A]  (hidden comment: CL10B104JB8NNNC)
C51  Capacitance: 0.1uF  [FP-CL10-0_1-IPC_A]  (hidden comment: CL10B104JB8NNNC)
C52  Capacitance: 10uF  [CAPC3216X180X50ML20T30]  (hidden comment: CL31B106KBHNNNE)
C53  Capacitance: 0.1uF  [FP-CL10-0_1-IPC_A]  (hidden comment: CL10B104JB8NNNC)
D6  Color: Green  [FP-LB_Q39E-MFG]  (hidden comment: LT Q39G-Q1OO-25-1)
D7  Color: Green  [FP-LB_Q39E-MFG]  (hidden comment: LT Q39G-Q1OO-25-1)
L3  Inductance: 15uH  [WE-PD-XXL]  (hidden comment: 7447709150)
Q7  MOSFET N-Channel, 40V, 100A, 272W  [LFPAK-PowerSO8]  (value not drawn)
Q8  MOSFET N-Channel, 40V, 100A, 272W  [LFPAK-PowerSO8]  (value not drawn)
R66  Resistance: 3.32kR  [RESC1608X55X30ML15T15]  (hidden comment: ERJ-3EKF3321V)
R67  Resistance: 2mR  [RESC2716X08N]  (hidden comment: CSR1206-0R002F1)
R68  Resistance: 100kR  [RESC1609X50X30ML10T20]  (hidden comment: CRCW0603-100KFKEA)
R69  Resistance: 10R  [FP-ERJ3EK-IPC_A]  (hidden comment: ERJ3EKF10R0V)
R70  Resistance: 10R  [FP-ERJ3EK-IPC_A]  (hidden comment: ERJ3EKF10R0V)
R71  Resistance: 10kR  [RESC1608X55X25ML10T15]  (hidden comment: RC0603FR-0710KL)
R72  Resistance: 6.65kR  [RESC0603(1608)_M]  (hidden comment: RC0603FR-076K65L)
R74  Resistance: 0.3mR  Max Power Dissipation: 3W  [RESC6332N(2512")]  (hidden comment: HCS2512FTL300)
R75  Resistance: 6.34kR  [RESC1609X50X30ML10T20]  (hidden comment: CRCW06036K34FKEA)
R76  Resistance: 10R  [FP-ERJ3EK-IPC_A]  (hidden comment: ERJ3EKF10R0V)
R77  Resistance: 10R  [FP-ERJ3EK-IPC_A]  (hidden comment: ERJ3EKF10R0V)
R78  value 20.5  [RESC1608N(0603")]  (hidden comment: 20.5 Ohm, 1%, 1/10W , 0603, SMD)
R79  value 20.5  [RESC1608N(0603")]  (hidden comment: 20.5 Ohm, 1%, 1/10W , 0603, SMD)
R80  value 10k  [RESC1608N(0603")]  (hidden comment: 10kR, 1%, 1/10W, 0603 SMD)
U9  BD9E302EFJ-E2  [FP-HTSOP-J8-IPC_A]
U10  INA226AIDGSR  [DGS0010A_M]
U11  INA226AIDGSR  [DGS0010A_M]
U12  MIC5014YM-TR  [SOC 8]
XF5  3557-2  [KSTN-3557-2]
XF6  3555-2  [3555-2-Footprint-1]

### Blocks framed on the sheet
VBatt External Supply, 18V to 28V, 60A: C51-C53 D7 Q7 Q8 R74-R80 U11 U12 XF6

### Ports
16V_Current_Alert (out), 16V_Enable (in), 16V_EXT (out), I2C_SCL (bidir), I2C_SDA (bidir), VBatt_Current_Alert (out), VBatt_Enable (in), VBatt_EXT (out)

### Nets
3V3: C50.1 C53.1 U10.1(A1) U10.2(A0) U10.6(VS+) U11.1(A1) U11.6(VS+)
GND: C40.2 C41.1 C43.1 C44.1 C45.1 C46.2 C47.1 C48.1 C49.1 C50.2 C52.2 C53.2 D6.1(Cathode) D7.1(Cathode) R71.1 R72.1 R80.2 U9.4(AGND) U9.7(PGND) U10.7(GND) U11.2(A0) U11.7(GND) U12.4(Gnd)
Motor_PWR: C52.1 Q7.5(Drain) Q8.5(Drain) U12.1(V+)
System_PWR: C40.1 C41.2 C46.1 C47.2 U9.2(VIN)
16V_Enable: R71.2 U9.3(EN) ; port 16V_Enable
16V_EXT: R67.1 R70.1 U10.8(VBUS) ; port 16V_EXT
16V_EXT_RAW: C43.2 C44.2 C48.2 C49.2 L3.2 R68.2 XF5.1 XF5.2
SCL: U10.5(SCL) U11.5(SCL) ; port I2C_SCL  [project net I2C_SCL]
SDA: U10.4(SDA) U11.4(SDA) ; port I2C_SDA  [project net I2C_SDA]
VBatt_EXT: R74.1 R77.1 U11.8(VBUS) ; port VBatt_EXT
NetC39_1: C39.1 U9.1(BOOT)
NetC39_2: C39.2 L3.1 U9.8(SW)
NetC42_1: C42.1 R70.2 U10.9(VIN-)
NetC42_2: C42.2 R69.2 U10.10(VIN+)
NetC45_2: C45.2 U9.6(COMP)
NetC51_1: C51.1 R77.2 U11.9(VIN-)
NetC51_2: C51.2 R76.2 U11.10(VIN+)
NetD6_2: D6.2(Anode) R66.1
NetD7_2: D7.2(Anode) R75.2
NetQ7_1: Q7.1(Source) Q7.2(Source) Q7.3(Source) Q8.1(Source) Q8.2(Source) Q8.3(Source) U12.3(Source) XF6.1 XF6.2
NetQ7_4: Q7.4(Gate) R78.1
NetQ8_4: Q8.4(Gate) R79.1
NetR66_2: R66.2 R67.2 R69.1 XF5.3 XF5.4
NetR68_1: R68.1 R72.2 U9.5(FB)
NetR74_2: R74.2 R75.1 R76.1 XF6.3 XF6.4
NetR78_2: R78.2 R79.2 U12.5(Gate)
NetR80_1: R80.1 U12.2(Input) ; port VBatt_Enable
NetU10_3: U10.3(ALERT) ; port 16V_Current_Alert
NetU11_3: U11.3(ALERT) ; port VBatt_Current_Alert

Not connected (* = marked no-connect by the designer): U9 9(E-Pad)

### Notes on the sheet
- 16V External Supply, 3A
- (near C40) NOSTUFF
- (near R66) Recommened Fuse: 3A 20V
  Suggested PN: F4193-ND
- (near C44) NOSTUFF
- Recommened Fuse: 50A 30V Slow Blow
  Suggested PN: F1038-ND
- Poorna Chander Kalidas

### Library data of the parts
C39 C41 C42 C47 C49-C51 C53 = CMP-00000-4: as C83-C87 on sheet Reed_Switch; Case Code (Imperial): 0603; Mount: Surface Mount; Thickness: 0.035inch; Depth: 0.8mm; Packaging: Tape and Reel; Package Quantity: 1; Dielectric: X7R; Height: 0.8mm; Radiation Hardening: No; Max Operating Temperature: 125°C; Voltage Rating: 50V; Case/Package: 0603; Min Operating Temperature: -55°C; Case Code (Metric): 1608; Length: 1.6mm; Contact Plating: Tin; Width: 0.031inch
  C39 C42 C50 C51 C53: Voltage: 50V
C40 C46 C52 = CMP-00004-2: Cap Ceramic 10uF 50V X7R 10% Pad SMD 1206 125°C T/R; Thickness: 0.071inch; Case/Package: 1206; Case Code (Metric): 3216; Case Code (Imperial): 1206; Voltage Rating: 50V; Length: 0.126inch; Max Operating Temperature: 125°C; Voltage Rating (DC): 50V; Dielectric: X7R; Lead Free: Lead Free; Min Operating Temperature: -55°C; Tolerance: 10%; Mount: Surface Mount; Packaging: Tape and Reel; Width: 0.063inch
C43 C44 C48 = CMP-00040-2: CAP CER 22UF 25V X7R 1210; Tolerance: 20%; Case/Package: 1210; Packaging: Tape and Reel; Mount: Surface Mount; Composition: Ceramic; Height: 2.5mm; Voltage Rating: 25V; Width: 0.098inch; Case Code (Imperial): 1210; Length: 0.126inch; Case Code (Metric): 3225; Voltage Rating (DC): 25V; Dielectric: X7R; Thickness: 0.106inch; Weight: 0.00388oz; Package Quantity: 4000; Max Operating Temperature: 125°C; Min Operating Temperature: -55°C; Termination: SMD/SMT
C45 = CMP-00005-3: SAMSUNG ELECTRO-MECHANICS - CL21B105KBFNNNG - MLCC CAPACITORS; Tolerance: 10%; Material: Ceramic; Dielectric: X7R; Case/Package: 0805; Voltage Rating: 50V; Contact Plating: Tin; Max Operating Temperature: 125°C; Termination: Wraparound; Package Quantity: 3000; Depth: 1.25mm; Mount: Surface Mount; Min Operating Temperature: -55°C; Thickness: 0.053inch; Packaging: Tape and Reel; Case Code (Metric): 2012; Length: 2mm; Case Code (Imperial): 0805; Width: 0.049inch
D6 D7 = CMP-00064-3: LED GREEN DIFFUSED 0603 SMD; Dominant Wavelength: 530nm; Luminous Intensity: 280mcd; Lens Style: Diffused,Colorless,Rectangular; Number of LEDs: 1; Forward Voltage: 2.85V; Test Current: 5mA; Reverse Voltage: 5V; Forward Current: 15mA; Luminous Flux: 0.55lm; Radiation Hardening: No; Packaging: Tape and Reel; Mount: Surface Mount; Max Operating Temperature: 85°C; Number of Elements: 1; Number of Pins: 2; Min Operating Temperature: -40°C; Depth: 0.9mm; Case/Package: SMD/SMT; Length: 1.7mm
L3 = CMP-00041-1: WURTH ELEKTRONIK - 7447709150 - Power Inductor (SMD), 15 µH, 6.5 A, Shielded, 8 A, WE-PD Series, 12mm x 12mm x 10mm; RMS Current (Irms): 6.5A; DC Resistance (DCR): 26mR; Saturation Current: 8A; Test Frequency: 1kHz; Core Material: Ferrite; Self Resonant Frequency: 17MHz; Tolerance: 20%; Height - Seated (Max): 0.394inch; Composition: Wirewound; Width: 12mm; Length: 12mm; Max DC Current: 6.5A; Weight: 0.02lb; Case Code (Metric): 3225; Number of Pins: 2; Packaging: Cut Tape; Lead Free: Lead Free; Case/Package: Nonstandard; Case Code (Imperial): 1210; Min Operating Temperature: -40°C; Series Resistance: 26mR; Resistance: 26mR; Lead Pitch: 7mm; Height: 10mm; Depth: 12mm; Mount: Surface Mount; Package Quantity: 250; Max Operating Temperature: 125°C; REACH SVHC: Unknown; Current Rating: 6.5A; Shielding: Shielded; Termination: SMD/SMT; Inductance Tolerance: 20%
Q7 Q8 = CMP-052-0019-1: MOSFET N-Channel, 40V, 100A, 272W, Enh-Mode; MFG#: PSMN1R8-40YLC,115; MFG: NXP Semiconductors; Reviewed_By: Ashwin Sira; Latest_Revision_Note: Attached footprint; Publisher: AUVic; Design Item ID: MOSFET N-Channel, 40V, 100A, 272W; Created By: Ashwin Sira; Component Type: Standard; Latest_Revision_Date: 2016_04_26; Source: AUVic_Schematic_Library_Transistors.SchLib; Latest_Revision_By: Ashwin Sira; Reviewed_Date: 2016_04_26; Pin Count: 5
R66 = CMP-00075-2: RES SMD 3.32K OHM 1% 1/10W 0603; Power Rating: 100mW; Voltage Rating (DC): 50V; Temperature Coefficient: 100ppm/°C; Voltage Rating: 75V; Military Standard: Not; Lead Free: Lead Free; Case/Package: 0603; Number of Terminations: 2; Min Operating Temperature: -55°C; Case Code (Metric): 1608; Mount: Surface Mount; Case Code (Imperial): 0603; REACH SVHC: No SVHC; Termination: SMD/SMT; Depth: 0.8mm; Max Power Dissipation: 100mW; Contact Plating: Tin; Max Operating Temperature: 155°C; Width: 0.031inch; Features: Automotive AEC-Q200; Packaging: Tape and Reel; Composition: Thick Film; Length: 1.6mm; Height: 0.45mm; Tolerance: 1%; Package Quantity: 5000; Radiation Hardening: No
R67 = CMP-00031-1: RES 0.002 OHM 1W 1% 1206; Temperature Coefficient: 50ppm/°C; Number of Terminations: 2; Composition: Metal Element; Case Code (Metric): 3216; Min Operating Temperature: -55°C; Length: 0.126inch; Tolerance: 1%; Packaging: Tape and Reel; Max Power Dissipation: 1W; Width: 0.063inch; Package Quantity: 1; Max Operating Temperature: 170°C; Height: 0.024inch; Case/Package: 1206; Case Code (Imperial): 1206
R68 = CMP-00036-2: as R107 on sheet Reed_Switch; Number of Terminations: 2; Number of Pins: 2; Contact Plating: Tin,Lead; Lead Free: Lead Free; Voltage Rating (DC): 75V; Package Quantity: 10; REACH SVHC: Unknown; Min Operating Temperature: -55°C; Height: 0.45mm; Composition: Thick Film; Case Code (Metric): 1608; Weight: 7.1E-05oz; Depth: 0.85mm; Features: Automotive AEC-Q200; Military Standard: Not; Tolerance: 1%; Radiation Hardening: No; Max Power Dissipation: 100mW; Case Code (Imperial): 0603; Max Operating Temperature: 155°C; Packaging: Tape and Reel; Width: 0.033inch; Case/Package: 0603; Termination: SMD/SMT; Length: 1.55mm
R69 R70 R76 R77 = CMP-00034-3: PANASONIC - ERJ3EKF10R0V - SMD Chip Resistor, 0603 [1608 Metric], 10 ohm, ERJ3EK Series, 75 V, Thick Film, 100 mW; Temperature Coefficient: 100ppm/°C; Tolerance: 1%; Max Power Dissipation: 100mW; Voltage Rating (DC): 75V; Package Quantity: 5000; Case Code (Imperial): 0603; Military Standard: Not; Depth: 0.8mm; Number of Terminations: 2; Working Voltage: 75V; Min Operating Temperature: -55°C; Width: 0.8mm; Composition: Thick Film; Packaging: Tape and Reel; Power Rating: 100mW; REACH SVHC: No SVHC; Max Operating Temperature: 155°C; Case Code (Metric): 1608; Features: Automotive AEC-Q200; Case/Package: 0603; Length: 1.6mm; Number of Pins: 2; Lead Free: Lead Free; Height: 0.45mm; Voltage Rating: 75V; Contact Plating: Tin; Termination: SMD/SMT; Mount: Surface Mount; Radiation Hardening: No
R71 = CMP-00037-2: as R108 on sheet Reed_Switch; Case/Package: 0603; Weight: 7.1E-05oz; Case Code (Imperial): 0603; Composition: Thick Film; Depth: 0.8mm; Min Operating Temperature: -55°C; Width: 0.8mm; Height: 0.45mm; Military Standard: Not; Packaging: Tape and Reel; Termination: SMD/SMT; Lead Free: Lead Free; Temperature Coefficient: 100ppm/°C; Number of Pins: 2; Max Operating Temperature: 155°C; Lead Pitch: 0.3mm; REACH SVHC: No SVHC; Case Code (Metric): 1608; Tolerance: 1%; Length: 1.6mm
R72 = CMP-00039-2: RES SMD 6.65K OHM 1% 1/10W 0603; Temperature Coefficient: 100ppm/°C; Voltage Rating: 50V; Max Power Dissipation: 100mW; Width: 0.031inch; Termination: SMD/SMT; Max Operating Temperature: 155°C; Tolerance: 1%; Lead Free: Lead Free; Package Quantity: 1; Case/Package: 0603; Number of Terminations: 2; Length: 1.6mm; Depth: 0.8mm; Height: 0.022inch; Min Operating Temperature: -55°C; Case Code (Metric): 1608; Power Rating: 100mW; Features: Moisture Resistant; Composition: Thick Film; Military Standard: Not; Voltage Rating (DC): 50V; Packaging: Tape and Reel; Case Code (Imperial): 0603
R74 = CMP-047-0000-2: 300 µOhms ±1% 3W Chip Resistor 2512 (6432 Metric) Automotive AEC-Q200, Current Sense, Moisture Resistant Metal Element; Temperature Coefficient: 150ppm/°C; Features: Moisture Resistant,Automotive AEC-Q200; Max Operating Temperature: 170°C; Length: 0.256inch; Tolerance: 1%; Case Code (Imperial): 2512; Case Code (Metric): 6432; Min Operating Temperature: -55°C; Number of Terminations: 2; Height: 0.038inch; Packaging: Cut Tape; Case/Package: 2512; Width: 0.128inch; Package Quantity: 4000; Composition: Metal Element
R75 = CMP-00072-2: VISHAY         CRCW06036K34FKEA.             SMD Chip Resistor, Thick Film, 6.34 kohm, 75 V, 0603 [1608 Metric], 100 mW,  1%, CRCW Series; Voltage Rating: 75V; Power Rating: 100mW; Temperature Coefficient: 100ppm/°C; Depth: 0.85mm; Military Standard: Not; Composition: Thick Film; Case Code (Metric): 1608; Case/Package: 0603; Packaging: Tape and Reel; Max Operating Temperature: 155°C; Tolerance: 1%; Height: 0.45mm; Package Quantity: 10; Case Code (Imperial): 0603; Width: 0.033inch; Length: 1.55mm; REACH SVHC: Unknown; Termination: SMD/SMT; Radiation Hardening: No; Contact Plating: Tin; Weight: 7.1E-05oz; Number of Pins: 2; Min Operating Temperature: -55°C; Features: Automotive AEC-Q200; Number of Terminations: 2; Max Power Dissipation: 100mW
R78 R79 = CMP-047-0030-1: Date Created: 2017-06-23; Source: AUVic_Schematic_Library_Resistors.SchLib; Pin Count: 2; Publisher: AUVic; Design Item ID: 20.5 Ohm, 1%, 1/10W , 0603, SMD; Created By: Gabriel Green; Component Type: Standard
R80 = CMP-047-0013-1: Owned By: AUVic; Made By: Ashwin Sira; Design Item ID: 10kR, 1%, 1/10W, 0603 SMD; Pin Count: 2; Component Type: Standard; Created On: 14-05-31; Last Edited: 14-05-31; Source: AUVic_Schematic_Library_Resistors.SchLib
U9 = CMP-08938-000005-1: IC REG BUCK ADJ 3A 8HTSOP-J; Output Type: Adjustable; Switching Frequency: 550kHz; Max Output Voltage: 19.6V; Min Input Voltage: 7V; Synchronous Rectifier: Yes; Min Output Voltage: 1V; Output Configuration: Positive; Max Input Voltage: 28V; Number of Outputs: 1; Packaging: Cut Tape; Mount: Surface Mount; Max Operating Temperature: 85°C; Min Operating Temperature: -40°C; Output Current: 3A
U10 U11 = CMP-00032-1: Bi Directional Current and Power Monitor 10-Pin VSSOP T/R; Nominal Supply Current: 330uA; Common Mode Rejection Ratio: 140dB; Output Current: 10mA; Accuracy: 0.02%; Input Bias Current: 10uA; Input Offset Voltage (Vos): 2.5uV; Min Supply Voltage: 2.7V; Max Supply Voltage: 5.5V; Mount: Surface Mount; Case/Package: VSSOP; Contact Plating: Gold; Radiation Hardening: No; Packaging: Tape and Reel; Package Quantity: 1; Max Operating Temperature: 125°C; Lead Free: Lead Free; Number of Pins: 10; Min Operating Temperature: -40°C; REACH SVHC: No SVHC
U12 = CMP-028-0000-2: High-Side or Low-Side Gate Driver IC Non-Inverting 8-SOIC; Number of Drivers: 1; Turn-On Delay Time: 8ms; Min Supply Voltage: 2.75V; Max Supply Voltage: 30V; Turn-Off Delay Time: 30us; Channel Type: Single; Max Output Current: 10mA; Lead Free: Lead Free; Max Operating Temperature: 85°C; Number of Pins: 8; Min Operating Temperature: -40°C; Height: 1.48mm; Mount: Surface Mount; Package Quantity: 2500; Case/Package: SOIC; Packaging: Tape and Reel; Number of Outputs: 1; Width: 3.94mm; Length: 4.93mm
XF5 = CMP-00030-4: Fuse Holder; Auto; 2 in1 Blade; THM; 1 Fuse; Vertical; 30 Amps; Current Rating: 20A; Voltage Rating (AC): 500V; Number of Poles: 1; Illumination Type: Illuminated; Fuse Type: Automotive; REACH SVHC: No SVHC; Lead Free: Lead Free; Max Operating Temperature: 145°C; Fuse Current: 20A; Min Operating Temperature: -50°C; Voltage: 500V; Contact Material: Brass; Orientation: Vertical; Package Quantity: 1; Depth: 6.8mm; Flammability Rating: UL94 V-0; Color: Black; Contact Plating: Tin; Termination: PC Pin; Material: Brass,Tin,Nylon; Number of Circuits: 1; Mount: Vertical,PCB; Length: 19.8mm
XF6 = CMP-00058-1: FUSE HOLDER MAXI AUTO BLADE PC; Approvals: UL; Number of Circuits: 1; Fuse Type: Automotive; Current Rating: 40A; Voltage Rating (AC): 500V; Illumination Type: Illuminated; Body Material: Nylon,Glass; Length: 35.8mm; Min Operating Temperature: -50°C; Color: Black; Orientation: Vertical; Package Quantity: 100; Number of Poles: 1; Contact Plating: Nickel; Material: Copper,Brass,Tin,Nylon; Max Operating Temperature: 145°C; Voltage: 500V; Lead Free: Lead Free; Termination: PC Pin; Mount: Vertical,PCB; Fuse Current: 40A; Contact Material: Copper,Tin; REACH SVHC: No SVHC; Depth: 5.9mm